# EAGLE board tkl3 (EAGLE 9.5.2)
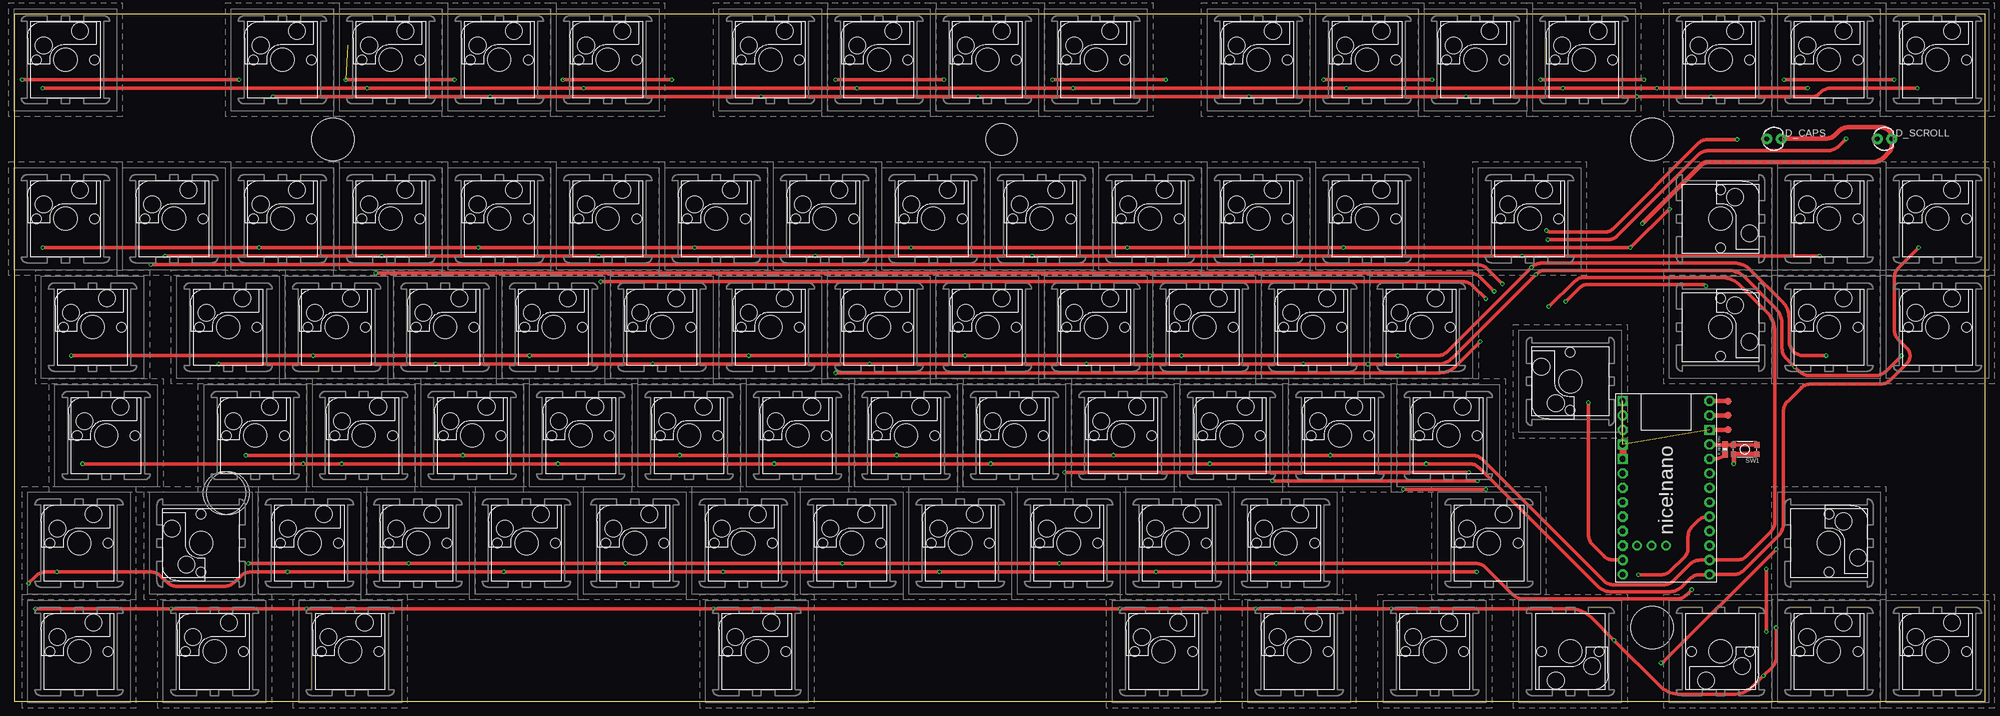
[diagram p2: board, top side]
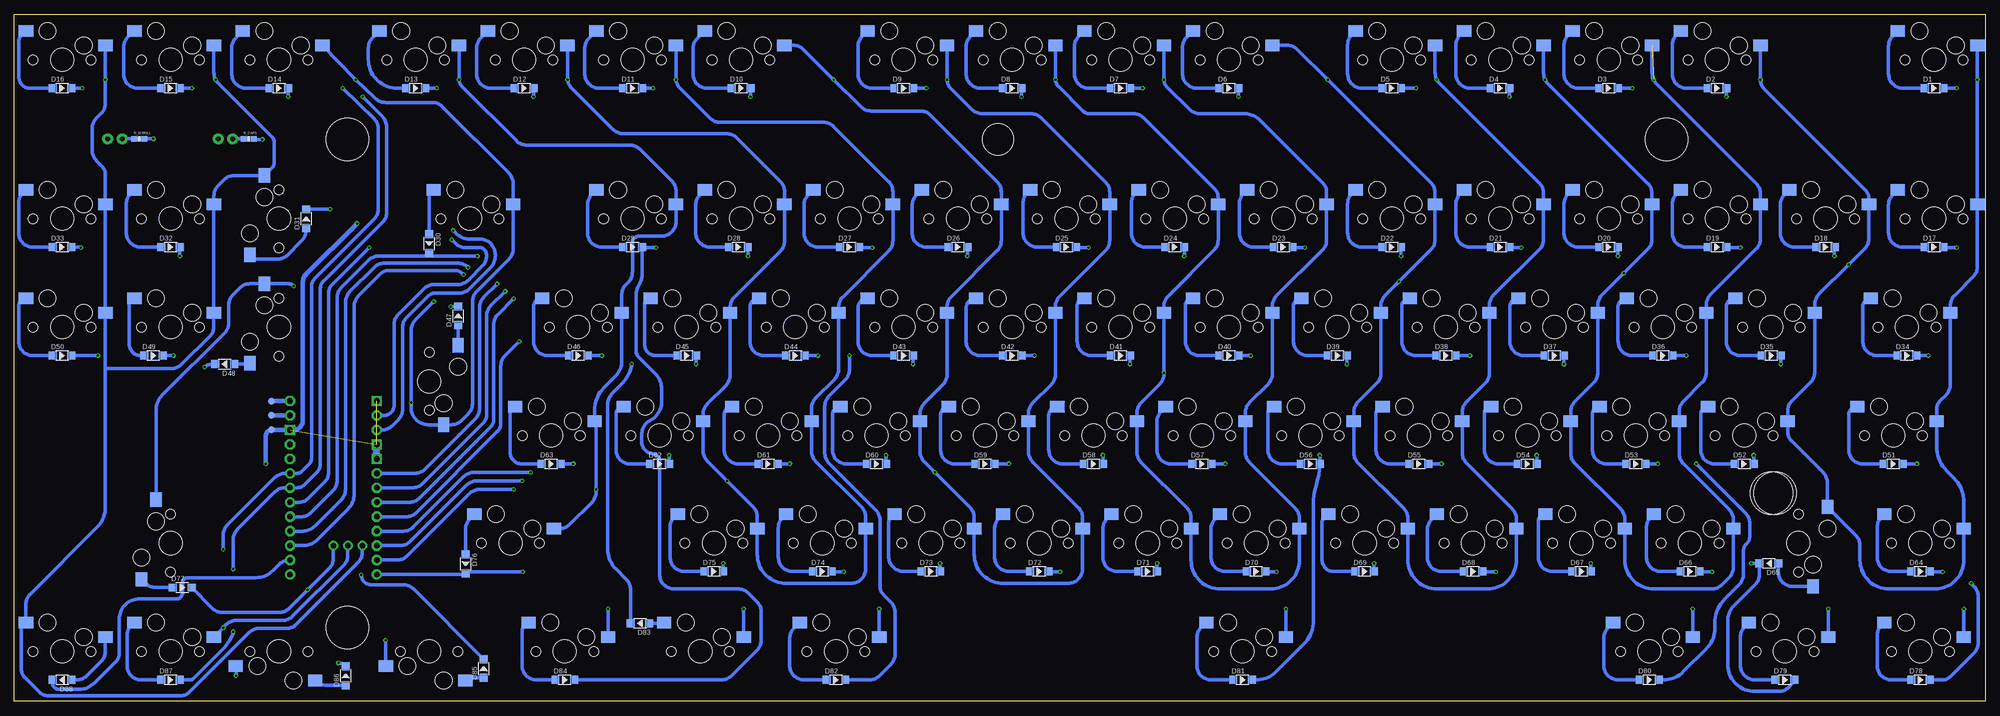
[diagram p3: board, bottom side, seen from below]

Size 346.2 x 120.73 mm. Coordinates in mm from the lower left corner, seen from the top.
Outline: 0,120.73 0,0 346.2,0 346.2,120.73 0,120.73
Copper layers (1*16): Top 0.035mm / dielectric 1.5mm / Bottom 0.035mm
Design rules "default *": minimum track width 6mil, minimum drill 0.35mm, track to track 16mil, track to pad 16mil, pad to pad 16mil, via to via 16mil, smd to smd 6mil, copper to edge 10mil, drill to drill 6mil, minimum pad ring 10mil, minimum via ring 8mil, stop-mask expansion 4mil, vias tented up to drill 0mil, thermal gap 10mil
Net classes: 0 default: width 0.152 mm, drill 0.305 mm, clearance 0.152 mm; 2 gnd: width 0.254 mm, drill 0.584 mm, clearance 0.203 mm
Holes 7.5 mm at 55.95,98.73 287.7,98.73 287.7,12.95 36.95,36.6 37.58,36.6
Holes 5.5 mm at 173.4,98.73
tKeepout: 13 lines

## Footprints (pad centres in the part's own frame; a part is rotated, then mirrored left to right if it is on the bottom)
SOD-123 = smd 1.397 x 1.397: + -1.651,0; - 1.651,0
LED3MM = drill 0.813 pad 1.88: A -1.27,0; K 1.27,0
CHERRY_MX_NO_LED_SOCKET_1U = smd 2.5 x 2 bottom: PIN1 6.35,5.08; PIN2 -7.62,2.54 | hole 4.089: 0,0 | hole 1.707: -5.08,0; 5.08,0 | hole 2.95: 2.54,5.08; -3.81,2.54
0603-RES = smd 1.1 x 1: 1 -0.85,0; 2 0.85,0
TACTILE_SWITCH_SMD_4.6X2.8MM = smd 0.9 x 1: 1 -2.05,-0.8; 2 2.05,-0.8; 3 2.05,0.8; 4 -2.05,0.8
PAD.03X.05 = smd 1.27 x 1.27: P$1 0,0
NICE_NANO = drill 1 pad 1.778 square: P1 0,0; P4 -7.62,0; P5 -10.16,0; P24 -5.08,-15.24 | drill 1 pad 1.778 octagon: P2 -2.54,0; P3 -5.08,0; P6 -12.7,0; P7 -15.24,0; P8 -17.78,0; P9 -20.32,0; P10 -22.86,0; P11 -25.4,0; P22 -10.16,-15.24; P23 -7.62,-15.24; P25 -2.54,-15.24; P26 0,-15.24 | drill 1 pad 1.778: P12 -27.94,0; P13 -30.48,0; P14 -30.48,-15.24; P15 -27.94,-15.24; P16 -25.4,-15.24; P17 -22.86,-15.24; P18 -20.32,-15.24; P19 -17.78,-15.24; P20 -15.24,-15.24; P21 -12.7,-15.24 | drill 1 pad 1.676: P27 -25.4,-2.54; P28 -25.4,-5.08; P29 -25.4,-7.62

## Placement (x,y rotation side)
D1  MMSD4148-sod123  [SOD-123]  9,107.73 0 bottom
D2  MMSD4148-sod123  [SOD-123]  47.1,107.73 0 bottom
D3  MMSD4148-sod123  [SOD-123]  66.15,107.73 0 bottom
D4  MMSD4148-sod123  [SOD-123]  85.2,107.73 0 bottom
D5  MMSD4148-sod123  [SOD-123]  104.25,107.73 0 bottom
D6  MMSD4148-sod123  [SOD-123]  132.82,107.73 0 bottom
D7  MMSD4148-sod123  [SOD-123]  151.88,107.73 0 bottom
D8  MMSD4148-sod123  [SOD-123]  170.93,107.73 0 bottom
D9  MMSD4148-sod123  [SOD-123]  189.97,107.73 0 bottom
D10  MMSD4148-sod123  [SOD-123]  218.55,107.73 0 bottom
D11  MMSD4148-sod123  [SOD-123]  237.6,107.73 0 bottom
D12  MMSD4148-sod123  [SOD-123]  256.65,107.73 0 bottom
D13  MMSD4148-sod123  [SOD-123]  275.7,107.73 0 bottom
D14  MMSD4148-sod123  [SOD-123]  299.7,107.73 0 bottom
D15  MMSD4148-sod123  [SOD-123]  318.75,107.73 0 bottom
D16  MMSD4148-sod123  [SOD-123]  337.8,107.73 0 bottom
D17  MMSD4148-sod123  [SOD-123]  9,79.79 0 bottom
D18  MMSD4148-sod123  [SOD-123]  28.05,79.79 0 bottom
D19  MMSD4148-sod123  [SOD-123]  47.1,79.79 0 bottom
D20  MMSD4148-sod123  [SOD-123]  66.15,79.79 0 bottom
D21  MMSD4148-sod123  [SOD-123]  85.2,79.79 0 bottom
D22  MMSD4148-sod123  [SOD-123]  104.25,79.79 0 bottom
D23  MMSD4148-sod123  [SOD-123]  123.3,79.79 0 bottom
D24  MMSD4148-sod123  [SOD-123]  142.35,79.79 0 bottom
D25  MMSD4148-sod123  [SOD-123]  161.4,79.79 0 bottom
D26  MMSD4148-sod123  [SOD-123]  180.45,79.79 0 bottom
D27  MMSD4148-sod123  [SOD-123]  199.5,79.79 0 bottom
D28  MMSD4148-sod123  [SOD-123]  219,79.79 0 bottom
D29  MMSD4148-sod123  [SOD-123]  237.6,79.79 0 bottom
D30  MMSD4148-sod123  [SOD-123]  273.32,80.42 270 bottom
D31  MMSD4148-sod123  [SOD-123]  294.94,84.79 90 bottom
D32  MMSD4148-sod123  [SOD-123]  318.75,79.79 0 bottom
D33  MMSD4148-sod123  [SOD-123]  337.8,79.79 0 bottom
D34  MMSD4148-sod123  [SOD-123]  13.76,60.73 0 bottom
D35  MMSD4148-sod123  [SOD-123]  37.58,60.73 0 bottom
D36  MMSD4148-sod123  [SOD-123]  56.62,60.73 0 bottom
D37  MMSD4148-sod123  [SOD-123]  75.67,60.73 0 bottom
D38  MMSD4148-sod123  [SOD-123]  94.72,60.73 0 bottom
D39  MMSD4148-sod123  [SOD-123]  113.78,60.73 0 bottom
D40  MMSD4148-sod123  [SOD-123]  132.82,60.73 0 bottom
D41  MMSD4148-sod123  [SOD-123]  151.88,60.73 0 bottom
D42  MMSD4148-sod123  [SOD-123]  170.93,60.73 0 bottom
D43  MMSD4148-sod123  [SOD-123]  189.97,60.73 0 bottom
D44  MMSD4148-sod123  [SOD-123]  209,60.73 0 bottom
D45  MMSD4148-sod123  [SOD-123]  228.07,60.73 0 bottom
D46  MMSD4148-sod123  [SOD-123]  247.12,60.73 0 bottom
D47  MMSD4148-sod123  [SOD-123]  268.25,67.73 90 bottom
D48  MMSD4148-sod123  [SOD-123]  309.25,59.23 180 bottom
D49  MMSD4148-sod123  [SOD-123]  321.75,60.73 0 bottom
D50  MMSD4148-sod123  [SOD-123]  337.8,60.73 0 bottom
D51  MMSD4148-sod123  [SOD-123]  16.14,41.69 0 bottom
D52  MMSD4148-sod123  [SOD-123]  42.34,41.69 0 bottom
D53  MMSD4148-sod123  [SOD-123]  61.39,41.69 0 bottom
D54  MMSD4148-sod123  [SOD-123]  80.44,41.69 0 bottom
D55  MMSD4148-sod123  [SOD-123]  99.49,41.69 0 bottom
D56  MMSD4148-sod123  [SOD-123]  118.54,41.69 0 bottom
D57  MMSD4148-sod123  [SOD-123]  137.59,41.69 0 bottom
D58  MMSD4148-sod123  [SOD-123]  156.64,41.69 0 bottom
D59  MMSD4148-sod123  [SOD-123]  175.69,41.69 0 bottom
D60  MMSD4148-sod123  [SOD-123]  194.74,41.69 0 bottom
D61  MMSD4148-sod123  [SOD-123]  213.79,41.69 0 bottom
D62  MMSD4148-sod123  [SOD-123]  232.84,41.69 0 bottom
D63  MMSD4148-sod123  [SOD-123]  251.89,41.69 0 bottom
D64  MMSD4148-sod123  [SOD-123]  11.38,22.8 0 bottom
D65  MMSD4148-sod123  [SOD-123]  38,24.23 180 bottom
D66  MMSD4148-sod123  [SOD-123]  51.86,22.8 0 bottom
D67  MMSD4148-sod123  [SOD-123]  70.91,22.8 0 bottom
D68  MMSD4148-sod123  [SOD-123]  89.96,22.8 0 bottom
D69  MMSD4148-sod123  [SOD-123]  109.01,22.8 0 bottom
D70  MMSD4148-sod123  [SOD-123]  128.06,22.8 0 bottom
D71  MMSD4148-sod123  [SOD-123]  147.11,22.8 0 bottom
D72  MMSD4148-sod123  [SOD-123]  166.16,22.8 0 bottom
D73  MMSD4148-sod123  [SOD-123]  185.21,22.8 0 bottom
D74  MMSD4148-sod123  [SOD-123]  204.26,22.8 0 bottom
D75  MMSD4148-sod123  [SOD-123]  223.31,22.8 0 bottom
D76  MMSD4148-sod123  [SOD-123]  266.93,24.14 270 bottom
D77  MMSD4148-sod123  [SOD-123]  316.68,19.98 0 bottom
D78  MMSD4148-sod123  [SOD-123]  11.38,3.75 0 bottom
D79  MMSD4148-sod123  [SOD-123]  35.19,3.75 0 bottom
D80  MMSD4148-sod123  [SOD-123]  59.01,3.75 0 bottom
D81  MMSD4148-sod123  [SOD-123]  130.44,3.75 0 bottom
D82  MMSD4148-sod123  [SOD-123]  201.88,3.75 0 bottom
D83  MMSD4148-sod123  [SOD-123]  236.31,13.71 180 bottom
D84  MMSD4148-sod123  [SOD-123]  249.51,3.75 0 bottom
D85  MMSD4148-sod123  [SOD-123]  263.75,5.75 90 bottom
D86  MMSD4148-sod123  [SOD-123]  288,4.48 90 bottom
D87  MMSD4148-sod123  [SOD-123]  318.75,3.75 0 bottom
D88  MMSD4148-sod123  [SOD-123]  337.8,3.75 180 bottom
D_CAPS  [LED3MM]  309.1,98.83 0 top
D_SCROLL  [LED3MM]  328.5,98.83 0 top
F_F2  CHERRY_MX1U  [CHERRY_MX_NO_LED_SOCKET_1U]  66.15,112.73 0 top
K_0  CHERRY_MX1U  [CHERRY_MX_NO_LED_SOCKET_1U]  199.5,84.79 0 top
K_1  CHERRY_MX1U  [CHERRY_MX_NO_LED_SOCKET_1U]  28.05,84.79 0 top
K_2  CHERRY_MX1U  [CHERRY_MX_NO_LED_SOCKET_1U]  47.1,84.79 0 top
K_3  CHERRY_MX1U  [CHERRY_MX_NO_LED_SOCKET_1U]  66.15,84.79 0 top
K_4  CHERRY_MX1U  [CHERRY_MX_NO_LED_SOCKET_1U]  85.2,84.79 0 top
K_5  CHERRY_MX1U  [CHERRY_MX_NO_LED_SOCKET_1U]  104.25,84.79 0 top
K_6  CHERRY_MX1U  [CHERRY_MX_NO_LED_SOCKET_1U]  123.3,84.79 0 top
K_7  CHERRY_MX1U  [CHERRY_MX_NO_LED_SOCKET_1U]  142.35,84.79 0 top
K_8  CHERRY_MX1U  [CHERRY_MX_NO_LED_SOCKET_1U]  161.4,84.79 0 top
K_9  CHERRY_MX1U  [CHERRY_MX_NO_LED_SOCKET_1U]  180.45,84.79 0 top
K_A  CHERRY_MX1U  [CHERRY_MX_NO_LED_SOCKET_1U]  42.34,46.69 0 top
K_B  CHERRY_MX1U  [CHERRY_MX_NO_LED_SOCKET_1U]  128.06,27.8 0 top
K_BACK  CHERRY_MX1U  [CHERRY_MX_NO_LED_SOCKET_1U]  266.18,84.79 0 top
K_C  CHERRY_MX1U  [CHERRY_MX_NO_LED_SOCKET_1U]  89.96,27.8 0 top
K_CAPSLOCK  CHERRY_MX1U  [CHERRY_MX_NO_LED_SOCKET_1U]  16.14,46.69 0 top
K_COMA  CHERRY_MX1U  [CHERRY_MX_NO_LED_SOCKET_1U]  185.21,27.8 0 top
K_D  CHERRY_MX1U  [CHERRY_MX_NO_LED_SOCKET_1U]  80.44,46.69 0 top
K_DELETE  CHERRY_MX1U  [CHERRY_MX_NO_LED_SOCKET_1U]  299.7,65.74 270 top
K_DOT  CHERRY_MX1U  [CHERRY_MX_NO_LED_SOCKET_1U]  204.26,27.8 0 top
K_DOWN  CHERRY_MX1U  [CHERRY_MX_NO_LED_SOCKET_1U]  318.75,8.75 0 top
K_E  CHERRY_MX1U  [CHERRY_MX_NO_LED_SOCKET_1U]  75.67,65.74 0 top
K_ECH  CHERRY_MX1U  [CHERRY_MX_NO_LED_SOCKET_1U]  9,112.73 0 top
K_END  CHERRY_MX1U  [CHERRY_MX_NO_LED_SOCKET_1U]  318.75,65.74 0 top
K_ENTER  CHERRY_MX1U  [CHERRY_MX_NO_LED_SOCKET_1U]  273.32,56.22 90 top
K_F  CHERRY_MX1U  [CHERRY_MX_NO_LED_SOCKET_1U]  99.49,46.69 0 top
K_F1  CHERRY_MX1U  [CHERRY_MX_NO_LED_SOCKET_1U]  47.1,112.73 0 top
K_F3  CHERRY_MX1U  [CHERRY_MX_NO_LED_SOCKET_1U]  85.2,112.73 0 top
K_F4  CHERRY_MX1U  [CHERRY_MX_NO_LED_SOCKET_1U]  104.25,112.73 0 top
K_F5  CHERRY_MX1U  [CHERRY_MX_NO_LED_SOCKET_1U]  132.82,112.73 0 top
K_F6  CHERRY_MX1U  [CHERRY_MX_NO_LED_SOCKET_1U]  151.88,112.73 0 top
K_F7  CHERRY_MX1U  [CHERRY_MX_NO_LED_SOCKET_1U]  170.93,112.73 0 top
K_F8  CHERRY_MX1U  [CHERRY_MX_NO_LED_SOCKET_1U]  189.97,112.73 0 top
K_F9  CHERRY_MX1U  [CHERRY_MX_NO_LED_SOCKET_1U]  218.55,112.73 0 top
K_F10  CHERRY_MX1U  [CHERRY_MX_NO_LED_SOCKET_1U]  237.6,112.73 0 top
K_F11  CHERRY_MX1U  [CHERRY_MX_NO_LED_SOCKET_1U]  256.65,112.73 0 top
K_F12  CHERRY_MX1U  [CHERRY_MX_NO_LED_SOCKET_1U]  275.7,112.73 0 top
K_FN  CHERRY_MX1U  [CHERRY_MX_NO_LED_SOCKET_1U]  273.32,8.75 180 top
K_G  CHERRY_MX1U  [CHERRY_MX_NO_LED_SOCKET_1U]  118.54,46.69 0 top
K_H  CHERRY_MX1U  [CHERRY_MX_NO_LED_SOCKET_1U]  137.59,46.69 0 top
K_HOME  CHERRY_MX1U  [CHERRY_MX_NO_LED_SOCKET_1U]  318.75,84.79 0 top
K_I  CHERRY_MX1U  [CHERRY_MX_NO_LED_SOCKET_1U]  170.93,65.74 0 top
K_INSERT  CHERRY_MX1U  [CHERRY_MX_NO_LED_SOCKET_1U]  299.7,84.79 270 top
K_J  CHERRY_MX1U  [CHERRY_MX_NO_LED_SOCKET_1U]  156.64,46.69 0 top
K_K  CHERRY_MX1U  [CHERRY_MX_NO_LED_SOCKET_1U]  175.69,46.69 0 top
K_L  CHERRY_MX1U  [CHERRY_MX_NO_LED_SOCKET_1U]  194.74,46.69 0 top
K_LALT  CHERRY_MX1U  [CHERRY_MX_NO_LED_SOCKET_1U]  59.01,8.75 0 top
K_LBRA  CHERRY_MX1U  [CHERRY_MX_NO_LED_SOCKET_1U]  228.07,65.74 0 top
K_LCTRL  CHERRY_MX1U  [CHERRY_MX_NO_LED_SOCKET_1U]  11.38,8.75 0 top
K_LEFT  CHERRY_MX1U  [CHERRY_MX_NO_LED_SOCKET_1U]  299.7,8.75 180 top
K_LSHFT  CHERRY_MX1U  [CHERRY_MX_NO_LED_SOCKET_1U]  11.38,27.8 0 top
K_LWIN  CHERRY_MX1U  [CHERRY_MX_NO_LED_SOCKET_1U]  35.19,8.75 0 top
K_M  CHERRY_MX1U  [CHERRY_MX_NO_LED_SOCKET_1U]  166.16,27.8 0 top
K_MINUS  CHERRY_MX1U  [CHERRY_MX_NO_LED_SOCKET_1U]  218.55,84.79 0 top
K_N  CHERRY_MX1U  [CHERRY_MX_NO_LED_SOCKET_1U]  147.11,27.8 0 top
K_O  CHERRY_MX1U  [CHERRY_MX_NO_LED_SOCKET_1U]  189.97,65.74 0 top
K_P  CHERRY_MX1U  [CHERRY_MX_NO_LED_SOCKET_1U]  209.03,65.74 0 top
K_PAUSE  CHERRY_MX1U  [CHERRY_MX_NO_LED_SOCKET_1U]  337.8,112.73 0 top
K_PDW  CHERRY_MX1U  [CHERRY_MX_NO_LED_SOCKET_1U]  337.8,65.74 0 top
K_PIPE  CHERRY_MX1U  [CHERRY_MX_NO_LED_SOCKET_1U]  32.81,27.8 90 top
K_PLUS  CHERRY_MX1U  [CHERRY_MX_NO_LED_SOCKET_1U]  237.6,84.79 0 top
K_PRNT  CHERRY_MX1U  [CHERRY_MX_NO_LED_SOCKET_1U]  299.7,112.73 0 top
K_PUP  CHERRY_MX1U  [CHERRY_MX_NO_LED_SOCKET_1U]  337.8,84.79 0 top
K_Q  CHERRY_MX1U  [CHERRY_MX_NO_LED_SOCKET_1U]  37.58,65.74 0 top
K_QUOTE  CHERRY_MX1U  [CHERRY_MX_NO_LED_SOCKET_1U]  232.84,46.69 0 top
K_R  CHERRY_MX1U  [CHERRY_MX_NO_LED_SOCKET_1U]  94.72,65.74 0 top
K_RALT  CHERRY_MX1U  [CHERRY_MX_NO_LED_SOCKET_1U]  201.88,8.75 0 top
K_RBRA  CHERRY_MX1U  [CHERRY_MX_NO_LED_SOCKET_1U]  247.12,65.74 0 top
K_RCTRL  CHERRY_MX1U  [CHERRY_MX_NO_LED_SOCKET_1U]  249.51,8.75 0 top
K_RIGHT  CHERRY_MX1U  [CHERRY_MX_NO_LED_SOCKET_1U]  337.8,8.75 0 top
K_RSHFT  CHERRY_MX1U  [CHERRY_MX_NO_LED_SOCKET_1U]  259.03,27.8 0 top
K_RWIN  CHERRY_MX1U  [CHERRY_MX_NO_LED_SOCKET_1U]  225.69,8.75 0 top
K_S  CHERRY_MX1U  [CHERRY_MX_NO_LED_SOCKET_1U]  61.39,46.69 0 top
K_SCROL  CHERRY_MX1U  [CHERRY_MX_NO_LED_SOCKET_1U]  318.75,112.73 0 top
K_SEMIC  CHERRY_MX1U  [CHERRY_MX_NO_LED_SOCKET_1U]  213.79,46.69 0 top
K_SLASH  CHERRY_MX1U  [CHERRY_MX_NO_LED_SOCKET_1U]  223.31,27.8 0 top
K_SPACE  CHERRY_MX1U  [CHERRY_MX_NO_LED_SOCKET_1U]  130.44,8.75 0 top
K_T  CHERRY_MX1U  [CHERRY_MX_NO_LED_SOCKET_1U]  113.78,65.74 0 top
K_TAB  CHERRY_MX1U  [CHERRY_MX_NO_LED_SOCKET_1U]  13.76,65.74 0 top
K_U  CHERRY_MX1U  [CHERRY_MX_NO_LED_SOCKET_1U]  151.88,65.74 0 top
K_UP  CHERRY_MX1U  [CHERRY_MX_NO_LED_SOCKET_1U]  318.75,27.8 270 top
K_V  CHERRY_MX1U  [CHERRY_MX_NO_LED_SOCKET_1U]  109.01,27.8 0 top
K_W  CHERRY_MX1U  [CHERRY_MX_NO_LED_SOCKET_1U]  56.62,65.74 0 top
K_WAVE  CHERRY_MX1U  [CHERRY_MX_NO_LED_SOCKET_1U]  251.89,46.69 0 top
K_X  CHERRY_MX1U  [CHERRY_MX_NO_LED_SOCKET_1U]  70.91,27.8 0 top
K_Y  CHERRY_MX1U  [CHERRY_MX_NO_LED_SOCKET_1U]  132.82,65.74 0 top
K_Z  CHERRY_MX1U  [CHERRY_MX_NO_LED_SOCKET_1U]  51.86,27.8 0 top
R_CAPS  4.7K  [0603-RES]  305,98.83 0 bottom
R_RESETPU  4.7K  [0603-RES]  300.5,44.23 90 top
R_SCROLL  4.7K  [0603-RES]  324.25,98.83 0 bottom
SW1  [TACTILE_SWITCH_SMD_4.6X2.8MM]  304,44.23 180 top
TP1  TEST-POINT3X5  [PAD.03X.05]  301,52.73 0 bottom
TP3  TEST-POINT3X5  [PAD.03X.05]  301,50.23 0 bottom
TP4  TEST-POINT3X5  [PAD.03X.05]  301,47.68 0 bottom
TP6  TEST-POINT3X5  [PAD.03X.05]  301,52.73 0 top
TP7  TEST-POINT3X5  [PAD.03X.05]  301,50.23 0 top
TP8  TEST-POINT3X5  [PAD.03X.05]  301,47.68 0 top
U$1  NICE_NANO  [NICE_NANO]  282.52,52.76 90 top
Κ_GRV  CHERRY_MX1U  [CHERRY_MX_NO_LED_SOCKET_1U]  9,84.79 0 top

## Tracks (layer width: path | path; a pad name or v marks a point on that pad's centre or on a via)
C0  (via drill 0.35)
  Top 0.61: v261.38,73.36 258.74,75.99 arc45 256.95,76.73 v24,76.73 | v1.38,109.23 v39.48,109.23
  Bottom 0.61: U$1.P6 275.85,40.06 arc-45 274.06,40.8 265.12,49.74 arc-45 264.48,51.29 264.48,69.2 arc45 263.73,71 v261.38,73.36 | K_1.PIN2 20.43,88.36 arc-45 21,89.73 38.74,107.47 arc45 39.48,109.26 v39.48,109.23
  Bottom 0.635: K_ECH.PIN2 v1.38,109.23 Κ_GRV.PIN2 1.38,76.4 arc45 2.12,74.61 5.4,71.33 arc-45 6.14,69.54 K_TAB.PIN2 6.14,55.64 arc45 6.89,53.85 8,52.73 arc-45 8.52,51.47 K_CAPSLOCK.PIN2 8.52,44.72 arc-45 6.78,40.51 5.5,39.24 arc45 3.76,35.03 K_LSHFT.PIN2 3.76,24.81 arc90 8.84,19.73 16.92,19.73 arc90 22,24.81 22,27.37 arc-45 22.74,29.16 K_PIPE.PIN1 27.73,38.41 arc-45 28.48,40.21 33.97,45.71 arc45 34.72,47.5 K_A.PIN2 34.72,51 arc45 34,52.73 30.7,56.03 arc-45 29.95,57.83 K_Q.PIN2 29.95,69.72 arc45 29.21,71.52 v24,76.73 21.17,79.56 arc-45 20.43,81.35 K_1.PIN2 | v39.48,109.23 K_F1.PIN2
C1  (via drill 0.35)  (1 unrouted)
  Top 0.61: v63.5,75.23 255.7,75.23 arc-45 257.49,74.49 v259.94,72.04 | v58.25,109.23 v77.33,109.23
  Bottom 0.61: 44.24,24.81 44.24,23.54 arc45 44.99,21.75 46.26,20.48 arc45 48.05,19.73 58.21,19.73 | U$1.P7 276.27,37.52 arc-45 274.47,38.26 263.83,48.9 arc-45 263.23,50.37 263.23,67.7 arc45 262.48,69.5 v259.94,72.04 | 40.22,90.96 57.79,108.52 arc45 58.53,110.31 F_F2.PIN2
  Bottom 0.635: 44.24,24.81 K_Z.PIN2 44.24,31.92 arc-45 44.99,33.72 53.02,41.76 arc45 53.77,43.55 K_S.PIN2 53.77,50.91 arc45 53.02,52.71 49.75,55.98 arc-45 49.01,57.78 K_W.PIN2 49.01,69.67 arc45 48.26,71.47 40.22,79.51 arc-45 39.48,81.3 K_2.PIN2 39.48,89.16 arc-45 40.22,90.96 | 58.21,19.73 arc90 63.29,24.81 K_X.PIN2 63.29,31.97 arc-45 64.04,33.77 72.07,41.81 arc45 72.82,43.6 K_D.PIN2 72.82,50.86 arc45 72.07,52.66 68.8,55.93 arc-45 68.06,57.73 K_E.PIN2 68.06,69.62 arc45 67.31,71.42 v63.5,75.23 59.27,79.46 arc-45 58.53,81.25 K_3.PIN2 58.53,89.21 arc-45 59.27,91.01 76.84,108.57 arc45 77.58,110.36 K_F3.PIN2
C2  (via drill 0.35)  (1 unrouted)
  Top 0.61: v103,73.73 254.45,73.73 arc-45 256.24,72.99 v258.5,70.73 | v115.5,109.23 96.5,109.23
  Bottom 0.61: U$1.P8 276.81,34.98 arc-45 275.01,35.72 262.55,48.19 arc-45 261.98,49.56 261.98,64.61 261.98,65.15 261.98,66.2 arc45 261.23,68 v258.5,70.73 | K_F4.PIN2 96.63,110.41 arc-45 95.89,108.62 78.32,91.06
  Bottom 0.635: 78.32,91.06 arc45 77.58,89.26 K_4.PIN2 77.58,81.2 arc45 78.32,79.41 86.36,71.37 arc-45 87.11,69.57 K_R.PIN2 87.11,57.68 arc45 87.85,55.88 91.12,52.61 arc-45 91.87,50.81 K_F.PIN2 91.87,43.65 arc-45 91.12,41.86 83.09,33.82 arc45 82.34,32.02 K_C.PIN2 82.34,24.81 arc90 87.42,19.73 96.31,19.73 arc90 101.39,24.81 K_V.PIN2 101.39,32.07 arc-45 102.14,33.87 110.17,41.91 arc45 110.92,43.7 K_G.PIN2 110.92,50.76 arc45 110.17,52.56 106.9,55.83 arc-45 106.16,57.63 K_T.PIN2 106.16,69.52 arc45 105.41,71.32 v103,73.73 97.37,79.36 arc-45 96.63,81.15 K_5.PIN2 96.63,89.31 arc-45 97.37,91.11 v115.5,109.23 120.8,114.53 arc-45 122.59,115.27 K_F5.PIN2
  other vias: 96.39,109.23
C3  (via drill 0.35)
  Top 0.61: v144.25,57.73 250.45,57.73 arc45 253.1,58.83 v257.5,63.23 | v144.25,109.23 163,109.23 arc-45 163.26,109.34 v163.31,109.23
  Bottom 0.61: 149.55,103.23 157.24,103.23 arc45 158.54,103.77 162.74,107.97 arc45 v163.31,109.23 K_F7.PIN2 | 130.05,103.23 137.74,103.23 arc45 139.89,104.12 143.69,107.92 arc45 v144.25,109.23 K_F6.PIN2 | U$1.P9 277.35,32.44 arc-45 275.55,33.18 261.44,47.3 arc-45 260.73,49.01 260.73,58.95 arc45 259.98,60.75 v257.5,63.23
  Bottom 0.635: 130.05,103.23 arc45 127.4,102.13 116.42,91.16 arc45 115.68,89.36 K_6.PIN2 115.68,81.1 arc45 116.42,79.31 124.46,71.27 arc-45 125.2,69.47 K_Y.PIN2 125.2,57.58 arc45 125.95,55.78 129.22,52.51 arc-45 129.97,50.71 K_H.PIN2 129.97,43.75 arc-45 129.22,41.96 121.19,33.92 arc45 120.44,32.12 K_B.PIN2 120.44,24.81 arc90 125.52,19.73 134.41,19.73 arc90 139.49,24.81 K_N.PIN2 139.49,32.17 arc-45 140.24,33.97 148.27,42.01 arc45 149.02,43.8 K_J.PIN2 149.02,50.66 arc45 148.27,52.46 145,55.73 arc-45 144.25,57.53 v144.25,57.73 K_U.PIN2 144.25,69.42 arc45 143.51,71.22 135.47,79.26 arc-45 134.73,81.05 K_7.PIN2 134.73,88.41 arc-45 135.47,90.21 147.76,102.49 arc-45 149.55,103.23
C4  (via drill 0.35)
  Top 0.61: v255.5,40.23 v184.5,40.23 | v182.35,109.23 v202.25,109.23
  Bottom 0.61: 187.05,103.73 195.7,103.73 arc45 197.49,104.48 v202.25,109.23 207.55,114.53 arc-45 209.34,115.27 K_F9.PIN2 | 167.55,103.23 175.99,103.23 arc45 178.14,104.12 181.61,107.59 arc45 v182.35,109.23 K_F8.PIN2 | 177.59,32.27 K_COMA.PIN2 177.59,25.81 arc-90 172.51,20.73 161.08,20.73 arc-90 158.54,23.27 158.54,24.81 | v255.5,40.23 265.45,40.23 arc-45 267.24,39.49 276.09,30.64 arc45 277.89,29.9 U$1.P10
  Bottom 0.635: 167.55,103.23 arc45 165.76,102.49 154.52,91.26 arc45 153.78,89.46 K_8.PIN2 153.78,81 arc45 154.52,79.21 162.56,71.17 arc-45 163.31,69.37 K_I.PIN2 163.31,57.48 arc45 164.05,55.68 167.32,52.41 arc-45 168.07,50.61 K_K.PIN2 168.07,43.85 arc-45 167.32,42.06 159.29,34.02 arc45 158.54,32.22 K_M.PIN2 158.54,24.81 | 187.05,103.73 arc45 185.26,102.99 173.57,91.31 arc45 172.83,89.51 K_9.PIN2 172.83,80.95 arc45 173.57,79.16 181.61,71.12 arc-45 182.35,69.32 K_O.PIN2 182.35,57.43 arc45 183.1,55.63 186.37,52.36 arc-45 187.12,50.56 K_L.PIN2 187.12,43.9 arc-45 186.37,42.11 v184.5,40.23 178.34,34.07 arc45 177.59,32.27
C5  (via drill 0.35)
  Top 0.61: v257,38.73 v221,38.73 | v229.98,109.23 v249.03,109.23
  Bottom 0.61: 221.05,99.73 239.2,99.73 arc45 240.99,100.48 248.29,107.77 arc45 249.03,109.56 v249.03,109.23 K_F11.PIN2 | 204.05,101.73 222.2,101.73 arc45 223.99,102.48 229.24,107.72 arc45 v229.98,109.23 K_F10.PIN2 | 215.69,32.37 K_SLASH.PIN2 215.69,25.81 arc-90 210.61,20.73 199.18,20.73 arc-90 196.64,23.27 K_DOT.PIN2 196.64,32.32 | v257,38.73 264.95,38.73 arc-45 266.74,37.99 276.63,28.1 arc45 278.43,27.36 U$1.P11
  Bottom 0.635: 204.05,101.73 arc45 202.26,100.99 192.62,91.36 arc45 191.88,89.56 K_0.PIN2 191.88,80.9 arc45 192.62,79.11 200.66,71.07 arc-45 201.41,69.27 K_P.PIN2 201.41,58.38 arc45 202.15,56.58 205.42,53.31 arc-45 206.17,51.51 K_SEMIC.PIN2 206.17,43.95 arc-45 205.42,42.16 197.39,34.12 arc45 196.64,32.32 | 215.69,32.37 arc-45 216.44,34.17 v221,38.73 224.47,42.21 arc45 225.22,44 K_QUOTE.PIN2 225.22,50.46 arc45 224.47,52.26 221.2,55.53 arc-45 220.46,57.33 K_LBRA.PIN2 220.46,69.22 arc45 219.71,71.02 211.67,79.06 arc-45 210.93,80.85 K_MINUS.PIN2 210.93,89.61 arc-45 211.67,91.41 219.26,98.99 arc-45 221.05,99.73
C6  (via drill 0.35)
  Top 0.61: v258.5,37.23 v244,37.23 | v297.12,72.98 arc45 296.52,73.23 276.23,73.23 arc45 274.99,72.72 v272.5,70.23 | v276.5,52.48 276.5,29.28 arc45 277.24,27.49 279.17,25.56 arc45 280.97,24.82 U$1.P12 | v268.08,109.23 v286.27,109.23
  Bottom 0.61: 238.05,97.73 256.2,97.73 arc45 257.99,98.48 267.34,107.82 arc45 v268.08,109.23 K_F12.PIN2 | K_PRNT.PIN2 v286.27,109.23 282.78,105.98 arc-45 280.99,105.23 272.8,105.23 arc45 271.01,104.49 259.3,92.78 arc45 258.56,90.98 K_BACK.PIN2 258.56,79.48 arc45 259.3,77.68 264.98,72 arc-45 265.73,70.2 265.73,69.15 265.73,68.48 265.73,52.22 arc45 266.41,50.58 267.64,49.34 arc45 269.44,48.6 K_ENTER.PIN2 273.46,48.6 arc90 276.5,51.64 v276.5,52.48 276.5,65.18 arc45 275.76,66.98 v272.5,70.23 | 244.27,49.73 arc45 244,49.09 v244,37.23 244,36.78 arc45 244.74,34.99 248.65,31.08 arc45 250.44,30.34 K_RSHFT.PIN2 | K_UP.PIN2 321.29,51.14 arc45 320.19,53.79 309.24,64.74 arc-45 308.5,66.53 308.5,69.68 arc45 307.76,71.48 306.61,72.62 arc45 304.82,73.36 K_DELETE.PIN2 297.98,73.36 arc45 297.17,73.02 v297.12,72.98 | K_PLUS.PIN2 229.98,84.27 arc90 232.52,81.73 236.5,81.73 arc-90 237.62,80.61 237.62,75.44 arc45 238.39,73.59 238.76,73.22 arc-45 239.5,71.42 239.5,69.17 | v258.5,37.23 264.45,37.23 arc-45 266.24,36.49 277.17,25.56 arc45 278.97,24.82 U$1.P12
  Bottom 0.635: K_PLUS.PIN2 229.98,89.66 arc-45 230.72,91.46 236.26,96.99 arc-45 238.05,97.73 | 239.5,69.17 K_RBRA.PIN2 239.5,59.78 arc45 240.6,57.13 242.64,55.09 arc-45 244.27,51.16 244.27,49.73 K_WAVE.PIN2
C7  (via drill 0.35)
  Top 0.61: v310.85,109.23 v330.18,109.23
  Bottom 0.61: U$1.P27 285.06,26.22 arc45 285.81,24.42 296.8,13.43 arc45 298.25,12.83 303.15,12.83 arc-45 304.94,12.09 315.36,1.68 arc45 317.15,0.93 340.05,0.93 arc45 341.84,1.68 344.26,4.09 arc45 345,5.88 345,12.98 K_RIGHT.PIN1 344.15,17.03 arc45 343.41,18.83 331.67,30.56 arc-45 330.18,34.16 330.18,58.48 | K_SCROL.PIN2 311.13,110.41 arc-45 310.39,108.62 300.92,99.15 arc45 300.5,98.14 300.5,94.75 arc45 300.92,93.73 K_INSERT.PIN2 307.52,92.41 arc-45 309.31,91.67 310.39,90.6 arc-45 311.13,88.8 K_HOME.PIN2 K_END.PIN2 311.13,65.9 arc45 311.87,64.11 316.76,59.23 arc45 318.55,58.48 330.18,58.48 | 330.18,58.48 K_PDW.PIN2 K_PUP.PIN2 330.18,92.61 arc-45 330.75,93.98 331.76,94.99 arc45 332.5,96.78 332.5,100.68 arc45 331.76,102.48 330.92,103.31 arc-45 330.18,105.1 v330.18,109.23 K_PAUSE.PIN2
C8  (via drill 0.35)
  Top 0.61: v3.75,16.23 v27.57,16.23 v51.39,16.23 v122.82,16.23 v194.26,16.23 v218.07,16.23 v241.89,16.23 273.4,16.23 arc-45 276.99,14.74 v281,10.73 289.01,2.72 arc45 292.6,1.23 301.9,1.23 arc45 305.49,2.72 v307.25,4.48 308.76,5.99 arc45 309.5,7.78 309.5,12.98 v309.47,12.95
  Bottom 0.61: K_LWIN.PIN2 arc-45 27.5,11.47 arc45 K_LWIN.PIN2 | v307.25,4.48 K_LEFT.PIN2 | v3.75,16.23 arc-45 3.76,16.2 K_LCTRL.PIN2 | 194,11.92 arc45 K_RALT.PIN2 v194.26,16.23 | K_FN.PIN2 arc45 281,6.36 v281,10.73 | U$1.P28 287.61,25.68 arc45 288.35,23.88 297.26,14.98 arc45 299.05,14.23 307.14,14.23 arc-45 308.93,13.49 v309.47,12.95 K_DOWN.PIN2 | K_RCTRL.PIN2 v241.89,16.23 | K_RWIN.PIN2 v218.07,16.23 | K_SPACE.PIN2 v122.82,16.23 | K_LALT.PIN2 v51.39,16.23 | K_LWIN.PIN2 v27.57,16.23
GND  (via drill 0.35)  (2 unrouted)
  Top 0.61: 306.1,43.48 arc90 SW1.4
  Top 0.813: 329.77,99.25 D_SCROLL.K | v286,83.98 296.18,94.16 arc-45 297.55,94.73 326.45,94.73 arc45 328.24,95.48 329.32,96.55 arc45 329.77,97.63 D_SCROLL.K | TP4.P$1 U$1.P24 | v302,41.73 302,43.38 arc90 SW1.3 SW1.4 306.05,43.33 | D_SCROLL.K 329.77,99.08 arc90 327.99,100.86 322.18,100.86 arc45 320.38,100.11 319.84,99.58 arc-45 318.05,98.83 D_CAPS.K
  Top 1.27: U$1.P4 U$1.P5
  Bottom 0.61: 295.5,49.44 arc45 296,48.23 arc45 297.34,47.68 U$1.P24
  Bottom 0.813: v286,83.98 294.93,75.05 arc-45 295.5,73.68 295.5,49.44 arc104 U$1.P24 TP4.P$1 TP4.P$1 arc-90 302,46.68 v302,41.73
  Bottom 1.27: U$1.P5 U$1.P4
L0  (via drill 0.35)
  Top 0.61: v5,107.73 v62,107.73 v100,107.73 v148,107.73 v186,107.73 v234,107.73 v272,107.73 v288.5,107.73 v315,107.73 | v289.25,6.73 arc45 289.68,6.91 v309.5,26.73
  Bottom 0.61: D1.- v5,107.73 | D13.- v272,107.73 | D11.- v234,107.73 | D9.- v186,107.73 | D7.- v148,107.73 | D5.- v100,107.73 | D3.- v62,107.73 | v315,107.73 D15.- | v288.5,107.73 282.91,102.27 arc45 282.25,100.68 282.25,86.53 arc45 282.99,84.74 293.26,74.48 arc-45 294,72.68 294,42.53 arc45 294.3,41.81 295.75,40.35 arc45 296.47,40.06 U$1.P21 298.62,40.06 arc-45 300.42,39.31 308.76,30.98 arc-45 309.5,29.18 v309.5,26.73 | D86.- 288.14,6.27 arc-45 v289.25,6.73
L1  (via drill 0.35)
  Top 0.61: v45.45,106.23 v83.55,106.23 v131.17,106.23 v169.27,106.23 v216.9,106.23 v255,106.23 v285,106.23 v298.05,106.23 315.79,106.23 arc45 317,106.73 317.26,106.99 arc-45 319.05,107.73 v334.25,107.73 | v307.75,12.23 v307.75,23.23
  Bottom 0.61: D12.- arc45 D12.- v255,106.23 | D16.- 336,107.58 arc45 335.64,107.73 v334.25,107.73 | D87.- 315.28,3.75 arc-45 314.77,3.96 309.75,8.98 arc-24 307.75,12.03 v307.75,12.23 | v285,106.23 281.67,102.9 arc45 280.75,100.68 280.75,86.03 arc45 281.49,84.24 291.76,73.98 arc-45 292.5,72.18 292.5,41.44 arc45 292.95,40.37 295.29,38.02 arc45 296.51,37.52 U$1.P20 298.66,37.52 arc-45 300.46,36.77 307.01,30.23 arc-45 307.75,28.43 v307.75,23.23 | 45.5,107.61 arc45 D2.- 45.45,106.35 arc45 v45.45,106.23 | D4.- 83.55,106.35 arc-45 v83.55,106.23 | D6.- v131.17,106.23 | D8.- v169.27,106.23 | D10.- v216.9,106.23 | D14.- v298.05,106.23
L2  (via drill 0.35)
  Top 0.61: v5,79.73 v43,79.73 v81.5,79.73 v119.5,79.73 v157.5,79.73 v195.5,79.73 v233.5,79.73 v283.88,79.73 v290.75,86.48
  Bottom 0.61: D17.- 7.35,79.73 v5,79.73 | D19.- 45.45,79.73 v43,79.73 | D21.- 83.55,79.73 v81.5,79.73 | D23.- 121.65,79.73 v119.5,79.73 | D25.- 159.75,79.73 v157.5,79.73 | D27.- 197.85,79.73 v195.5,79.73 | v233.5,79.73 235.95,79.73 D29.- 235.95,74.81 arc33 236.38,73.36 arc-30 237,71.4 237,61.68 arc-45 236.51,60.49 233.6,57.58 arc45 232.5,54.93 232.5,52.73 arc49 233.71,49.9 arc14 234.52,49.32 arc-55 236,47.11 arc-12 236,45.48 arc-78 234,43.48 arc84 232.84,42.19 232.84,22.27 arc-90 230.3,19.73 219.05,19.73 arc45 217.26,18.99 215.74,17.48 arc45 215,15.68 215,10.78 arc45 215.74,8.99 220.24,4.49 arc45 222.03,3.75 D84.- | U$1.P19 296.13,34.98 arc-45 294.69,35.57 291.6,38.67 arc-45 291,40.11 291,71.68 arc45 290.34,73.26 v283.88,79.73 | v290.75,86.48 294.85,86.48 arc-45 D31.-
L3  (via drill 0.35)
  Top 0.61: v26.5,78.23 v64.5,78.23 v102.6,78.23 v140.7,78.23 v178.8,78.23 v217.35,78.23 v264.88,78.23 v317.1,78.23 | v285.25,22.23 289.2,22.23 arc45 290.99,22.98 293.26,25.24 arc45 294,27.03 294,28.93 arc-45 294.74,30.73 295.71,31.69 arc-45 297.51,32.44 U$1.P18
  Bottom 0.61: D18.- arc45 26.5,79.55 v26.5,78.23 | 264.9,78.26 v264.88,78.23 273.5,78.23 | D20.- D20.- arc45 D20.- v64.5,78.23 | D22.- v102.6,78.23 | D24.- v140.7,78.23 | D26.- v178.8,78.23 | 316.95,79.73 arc45 D32.- | 273.5,78.23 282.2,78.23 arc-45 283.99,77.49 288.76,72.73 arc-45 289.5,70.93 289.5,38.77 arc45 290.24,36.97 294.04,33.18 arc45 295.83,32.44 U$1.P18 | D85.- 276.09,19.74 arc-45 277.88,20.48 283.5,20.48 arc90 v285.25,22.23 | D30.- 273.5,78.77 273.5,78.23 | 317,79.55 arc-45 D32.- | D28.- v217.35,78.23 | D32.- v317.1,78.23
L4  (via drill 0.35)
  Top 0.61: v10,60.73 v52.5,60.73 v90.5,60.73 v129,60.73 v167,60.73 v199.5,60.73 v205,60.73 v243,60.73 249.95,60.73 arc45 251.74,61.48 v266.51,76.24 arc-45 268.3,76.98 302.15,76.98 arc-45 304.88,75.85 310.62,70.12 arc-45 311.75,67.38 311.75,63.27 arc90 314.29,60.73 v318.25,60.73
  Bottom 0.61: D34.- v10,60.73 | D36.- v52.5,60.73 | D38.- v90.5,60.73 | D40.- v129,60.73 | D42.- v167,60.73 | D44.- v205,60.73 | D46.- v243,60.73 | v318.25,60.73 D49.- | v199.5,60.73 199.5,58.28 arc45 200.24,56.49 203.01,53.73 arc-45 203.88,51.63 203.88,43.84 arc-45 203.01,41.74 194.99,33.73 arc45 194.12,31.63 194.12,20.23 arc-45 193.51,18.74 192.24,17.48 arc45 191.5,15.68 191.5,8.23 arc45 192.21,6.52 194.24,4.49 arc45 196.03,3.75 D82.- | U$1.P17 295.54,29.9 arc-45 293.38,30.79 288.89,35.28 arc-45 288,37.43 288,70.18 arc45 287.26,71.98 282.99,76.24 arc45 281.2,76.98 268.3,76.98 arc45 v266.51,76.24
L5  (via drill 0.35)
  Top 0.61: v35.92,59.23 v74,59.23 v112.12,59.23 v150.22,59.23 v188.32,59.23 v226.42,59.23 v237.75,59.23 249.95,59.23 arc45 252.6,60.33 v267.26,74.99 arc-45 269.05,75.73 300.9,75.73 arc-45 304.06,74.42 309.19,69.29 arc-45 310.5,66.13 310.5,62.03 arc45 311.24,60.24 v312.75,58.73 313.51,57.98 arc45 315.3,57.23 326.95,57.23 arc45 328.74,57.98 v331.5,60.73
  Bottom 0.61: 36,60.55 arc-45 D35.- v35.92,59.23 | D37.- 74.02,59.26 v74,59.23 | D41.- v150.22,59.23 | D50.- v331.5,60.73 | D83.- 237.96,19.64 arc-45 238.7,21.43 240.51,23.24 arc45 242,26.84 242,52.06 arc45 241.17,54.06 239.75,55.48 arc-16 238.25,57.48 arc-26 v237.75,59.23 | D48.- 311.54,59.23 arc-45 v312.75,58.73 | U$1.P16 295.49,27.36 arc-45 292.98,28.4 287.54,33.83 arc-45 286.5,36.35 286.5,69.43 arc45 285.76,71.23 281.99,74.99 arc45 280.2,75.73 269.05,75.73 arc45 v267.26,74.99 | D39.- v112.12,59.23 | D43.- v188.32,59.23 | D45.- v226.42,59.23
L6  (via drill 0.35)
  Top 0.61: v40.69,43.23 v78.79,43.23 v116.89,43.23 v155,43.23 v193.09,43.23 v231.19,43.23 256.07,43.23 arc-45 257.87,42.49 279.13,21.23 arc45 280.93,20.48 289.7,20.48 arc45 291.49,21.23 294.34,24.07 arc-45 296.14,24.82 U$1.P15 302.53,24.82 arc45 304.33,25.56 308.51,29.74 arc45 309.25,31.53 309.25,64.88 arc45 307.76,68.47 303.24,72.99 arc45 299.65,74.48 275.8,74.48 arc45 274.01,73.74 v269.51,69.38
  Bottom 0.61: D56.- arc45 117,41.97 | D58.- arc45 155,41.72 v155,43.23 | 193,41.9 arc45 D60.- v193.09,43.23 | D88.- 339.45,3.07 arc-45 339.2,2.46 arc-45 338.35,2.11 334.75,2.11 arc-45 332.15,3.18 328.35,6.98 arc-45 327.75,8.43 327.75,14.44 arc90 324.21,17.98 317.75,17.98 arc-90 316.62,19.11 316.62,20.86 arc90 315.75,21.73 303.76,21.73 arc-45 300.76,22.98 299.73,24 arc45 U$1.P15 | D81.- 128.08,3.75 arc-45 124.49,5.24 119.74,9.99 arc-45 118,14.19 118,34.53 arc16 117.5,37.98 arc-14 D56.- | v269.51,69.38 D47.- | D62.- v231.19,43.23 | D56.- v116.89,43.23 | D54.- v78.79,43.23 | D52.- v40.69,43.23
L7  (via drill 0.35)
  Top 0.61: v12,41.73 v50.75,41.73 v57.5,41.73 v95.5,41.73 v133.5,41.73 v171.5,41.73 v210,41.73 v248,41.73 255.57,41.73 arc-45 257.37,40.99 278.13,20.23 arc45 280.53,19.23 290.59,19.23 arc45 292.99,20.23 294.29,21.52 arc-45 296,22.23 297.66,22.23 arc45 U$1.P14 301.99,22.28 arc45 303.79,23.02 309.9,29.13 arc45 310.75,31.18 310.75,50.93 arc-45 311.49,52.73 313.76,54.99 arc-45 315.55,55.73 327.7,55.73 arc45 329.49,56.48 332.47,59.45 arc45 333,60.73 arc45 332.47,62.01 330.99,63.49 arc-45 330.25,65.28 330.25,74.43 arc-45 330.99,76.23 v334.5,79.73
  Bottom 0.61: D51.- arc45 14.4,41.73 v12,41.73 | D53.- arc45 59.64,41.73 v57.5,41.73 | D57.- arc45 135.84,41.73 v133.5,41.73 | D55.- arc45 97.74,41.73 v95.5,41.73 | D59.- arc45 173.94,41.73 v171.5,41.73 | D61.- arc45 212.04,41.73 v210,41.73 | D63.- arc45 250.14,41.73 v248,41.73 | D80.- 56.59,3.75 arc-45 52.99,5.24 48.99,9.24 arc-45 47.5,12.84 47.5,14.23 arc38 45.75,17.98 43.24,20.49 arc-45 42.5,22.28 42.5,26.22 arc45 41.88,27.73 arc-45 41.38,28.94 41.38,31.28 arc-45 42.13,33.12 v50.75,41.73 | v334.5,79.73 arc-45 334.64,79.79 D33.-
L8  (via drill 0.35)
  Top 0.61: v41.12,24.23 v69.26,24.23 v107.36,24.23 v145.46,24.23 v183.56,24.23 v221.66,24.23 256.7,24.23 arc-45 258.49,23.49 263.26,18.73 arc45 265.05,17.98 291.95,17.98 arc45 293.74,18.73 v294.62,19.61
  Bottom 0.61: 69,23.06 arc90 D67.- v69.26,24.23 | 107.5,22.94 arc-90 D69.- v107.36,24.23 | 145.5,22.84 arc-90 D71.- v145.46,24.23 | v41.12,24.23 D65.- 39.65,22.38 arc45 40.39,20.59 44,16.98 arc-45 45.25,13.96 45.25,6.48 arc-90 40.5,1.73 36.3,1.73 arc-45 34.51,2.48 33.76,3.22 arc-45 D79.- | 183.5,22.95 arc45 D73.- v183.56,24.23 | 221.5,23.19 arc45 D75.- v221.66,24.23 | U$1.P29 290.14,25.14 arc45 290.89,23.34 v294.62,19.61 297.88,16.35 arc45 299.68,15.61 309.6,15.61 arc45 311.4,16.35 D77.-
L9  (via drill 0.35)
  Top 0.61: v2.5,20.73 3.76,21.99 arc-45 5.55,22.73 v7.5,22.73 23.95,22.73 arc-45 25.74,21.99 26.76,20.98 arc45 28.55,20.23 36.95,20.23 arc45 38.74,20.98 39.76,21.99 arc-45 41.55,22.73 v48,22.73 v86,22.73 v124.5,22.73 v162.5,22.73 v200.5,22.73 v256.88,22.73
  Bottom 0.61: D64.- arc-45 9.56,22.73 v7.5,22.73 | D66.- arc-45 50.05,22.73 v48,22.73 | D68.- arc-45 88.15,22.73 v86,22.73 | D70.- arc-45 126.25,22.73 v124.5,22.73 | D72.- arc-45 164.35,22.73 v162.5,22.73 | D78.- 7.53,3.75 arc-45 6.16,4.32 1.92,8.56 arc-45 1.25,10.18 1.25,18.53 arc-45 1.92,20.15 v2.5,20.73 | v200.5,22.73 202.45,22.73 arc45 D74.- | v256.88,22.73 266.75,22.73 | 266.75,22.73 266.93,22.73 D76.- | U$1.P13 266.75,22.28 266.75,22.73
N$1
  Bottom 0.61: K_RIGHT.PIN2 330.18,8.85 arc45 330.92,7.06 333.49,4.49 arc45 335.28,3.75 D88.+
N$2
  Bottom 0.635: K_ECH.PIN1 16.26,116.91 arc-45 17,115.11 17,110.27 arc-90 14.46,107.73 D1.+
N$3
  Bottom 0.635: K_F1.PIN1 54.26,117.01 arc-45 55,115.21 55,111.23 55,110.73 55,110.27 arc-90 52.46,107.73 D2.+
N$4
  Bottom 0.635: F_F2.PIN1 73.26,117.06 arc-45 74,115.26 74,110.27 arc-90 71.46,107.73 D3.+
N$5
  Bottom 0.635: K_F3.PIN1 92.26,117.11 arc-45 93,115.31 93,110.27 arc-90 90.46,107.73 D4.+
N$6
  Bottom 0.635: K_F4.PIN1 111.26,117.16 arc-45 112,115.36 112,110.27 arc-90 109.46,107.73 D5.+
N$7
  Bottom 0.635: K_F5.PIN1 140.26,116.73 arc-45 141,114.93 141,110.27 arc-90 138.46,107.73 D6.+
N$8
  Bottom 0.635: K_F6.PIN1 159.26,116.78 arc-45 160,114.98 160,110.27 arc-90 157.46,107.73 D7.+
N$9
  Bottom 0.635: K_F7.PIN1 178.26,116.83 arc-45 179,115.03 179,110.27 arc-90 176.46,107.73 D8.+
N$10
  Bottom 0.635: K_F8.PIN1 197.26,116.88 arc-45 198,115.08 198,110.27 arc-90 195.46,107.73 D9.+
N$11
  Bottom 0.635: K_F9.PIN1 226.26,116.46 arc-45 227,114.66 227,110.27 arc-90 224.46,107.73 D10.+
N$12
  Bottom 0.635: K_F10.PIN1 245.26,116.51 arc-45 246,114.71 246,110.27 arc-90 243.46,107.73 D11.+
N$13
  Bottom 0.635: K_F11.PIN1 264.26,116.56 arc-45 265,114.76 265,110.27 arc-90 262.46,107.73 D12.+
N$14
  Bottom 0.635: K_F12.PIN1 283.26,116.61 arc-45 284,114.81 284,112.81 arc-90 278.92,107.73 D13.+
N$15
  Bottom 0.635: K_PRNT.PIN1 307.26,116.61 arc-45 308,114.81 308,110.27 arc-90 305.46,107.73 D14.+
N$16
  Bottom 0.635: K_SCROL.PIN1 326.26,116.66 arc-45 327,114.86 327,110.27 arc-90 324.46,107.73 D15.+
N$17
  Bottom 0.635: K_PAUSE.PIN1 344.99,116.97 arc-45 345.38,116.04 345.38,109.65 arc-90 343.46,107.73 D16.+
N$18
  Bottom 0.635: K_PUP.PIN1 344.76,89.27 arc-45 345.38,87.77 345.38,82.21 arc-90 342.96,79.79 D33.+
N$19
  Bottom 0.635: K_HOME.PIN1 325.76,89.22 arc-45 326.5,87.42 326.5,82.33 arc-90 323.96,79.79 D32.+
N$20
  Bottom 0.61: K_INSERT.PIN1 arc-90 304.07,77.73 299.75,77.73 arc-45 298.26,78.35 295.77,80.83 arc-45 294.94,82.84 D31.+
N$21
  Bottom 0.61: D30.+ 273.32,89.87 K_BACK.PIN1
N$22
  Bottom 0.635: K_PLUS.PIN1 244.76,89.07 arc-45 245.5,87.27 245.5,82.33 arc-90 242.96,79.79 D29.+
N$23
  Bottom 0.635: K_MINUS.PIN1 225.76,89.02 arc-45 226.5,87.22 226.5,82.33 arc-90 223.96,79.79 D28.+
N$24
  Bottom 0.635: K_0.PIN1 206.76,88.97 arc-45 207.5,87.17 207.5,82.33 arc-90 204.96,79.79 D27.+
N$25
  Bottom 0.635: K_9.PIN1 187.76,88.92 arc-45 188.5,87.12 188.5,82.33 arc-90 185.96,79.79 D26.+
N$26
  Bottom 0.635: K_8.PIN1 168.26,89.37 arc-45 169,87.57 169,82.33 arc-90 166.46,79.79 D25.+
N$27
  Bottom 0.635: K_7.PIN1 149.26,89.32 arc-45 150,87.52 150,83.73 150,83.23 150,82.33 arc-90 147.46,79.79 D24.+
N$28
  Bottom 0.635: K_6.PIN1 130.26,89.27 arc-45 131,87.47 131,82.33 arc-90 128.46,79.79 D23.+
N$29
  Bottom 0.635: K_5.PIN1 111.26,89.22 arc-45 112,87.42 112,82.33 arc-90 109.46,79.79 D22.+
N$30
  Bottom 0.635: K_4.PIN1 92.26,89.17 arc-45 93,87.37 93,82.33 arc-90 90.46,79.79 D21.+
N$31
  Bottom 0.635: K_3.PIN1 73.26,89.12 arc-45 74,87.32 74,85.23 74,84.73 74,82.33 arc-90 71.46,79.79 D20.+
N$32
  Bottom 0.635: K_2.PIN1 54.26,89.07 arc-45 55,87.27 55,82.33 arc-90 52.46,79.79 D19.+
N$33
  Bottom 0.635: K_1.PIN1 35.26,89.02 arc-45 36,87.22 36,82.33 arc-90 33.46,79.79 D18.+
N$34
  Bottom 0.635: Κ_GRV.PIN1 16.26,88.97 arc-45 17,87.17 17,82.33 arc-90 14.46,79.79 D17.+
N$35
  Bottom 0.635: K_TAB.PIN1 arc-90 21.5,69.43 21.5,63.27 arc-90 18.96,60.73 D34.+
N$36
  Bottom 0.635: K_Q.PIN1 arc-90 45.5,69.25 45.5,63.27 arc-90 42.96,60.73 D35.+
N$37
  Bottom 0.635: K_W.PIN1 arc-90 64.5,69.3 64.5,63.27 arc-90 61.96,60.73 D36.+
N$38
  Bottom 0.635: K_E.PIN1 arc-90 83.5,69.35 83.5,63.27 arc-90 80.96,60.73 D37.+
N$39
  Bottom 0.635: K_R.PIN1 arc-90 102.5,69.4 102.5,63.27 arc-90 99.96,60.73 D38.+
N$40
  Bottom 0.635: K_T.PIN1 arc-90 121.5,69.45 121.5,66.23 121.5,65.73 121.5,63.27 arc-90 118.96,60.73 D39.+
N$41
  Bottom 0.635: K_Y.PIN1 arc-90 140.5,69.5 140.5,63.27 arc-90 137.96,60.73 D40.+
N$42
  Bottom 0.635: K_U.PIN1 arc-90 159.5,69.55 159.5,63.27 arc-90 156.96,60.73 D41.+
N$43
  Bottom 0.635: K_I.PIN1 arc-90 179,69.1 179,65.73 179,65.23 179,63.27 arc-90 176.46,60.73 D42.+
N$44
  Bottom 0.635: K_O.PIN1 arc-90 198,69.15 198,63.27 arc-90 195.46,60.73 D43.+
N$45
  Bottom 0.635: K_P.PIN1 arc-90 217,69.2 217,63.27 arc-90 214.46,60.73 D44.+
N$46
  Bottom 0.635: K_LBRA.PIN1 arc-90 235.5,69.75 235.5,62.77 arc-90 233.46,60.73 D45.+
N$47
  Bottom 0.635: K_RBRA.PIN1 arc-90 255,69.3 255,63.27 arc-90 252.46,60.73 D46.+
N$48
  Bottom 0.61: D47.+ K_ENTER.PIN1 arc-90 K_ENTER.PIN1
N$49
  Bottom 0.61: D48.+ 304.94,59.23 arc-90 K_DELETE.PIN1
N$50
  Bottom 0.635: K_END.PIN1 arc-90 326,69.92 326,62.77 arc-90 323.96,60.73 D49.+
N$51
  Bottom 0.635: K_PDW.PIN1 arc-90 345.38,69.6 345.38,63.15 arc-90 342.96,60.73 D50.+
N$52
  Bottom 0.635: K_CAPSLOCK.PIN1 arc-90 24,50.27 24,44.23 arc-90 21.46,41.69 D51.+
N$53
  Bottom 0.635: K_A.PIN1 arc-90 50,50.46 50,44.23 arc-90 47.46,41.69 D52.+
N$54
  Bottom 0.635: K_S.PIN1 arc-90 69,50.51 69,44.23 arc-90 66.46,41.69 D53.+
N$55
  Bottom 0.635: K_D.PIN1 arc-90 88,50.56 88,44.23 arc-90 85.46,41.69 D54.+
N$56
  Bottom 0.635: K_F.PIN1 arc-90 107,50.61 107,44.23 arc-90 104.46,41.69 D55.+
N$57
  Bottom 0.635: K_G.PIN1 arc-90 126,50.66 126,44.23 arc-90 123.46,41.69 D56.+
N$58
  Bottom 0.635: K_H.PIN1 144.76,50.95 arc-45 145.5,49.16 145.5,44.23 arc-90 142.96,41.69 D57.+
N$59
  Bottom 0.635: K_J.PIN1 arc-90 164.5,50.26 164.5,44.23 arc-90 161.96,41.69 D58.+
N$60
  Bottom 0.635: K_K.PIN1 arc-90 183.5,50.31 183.5,44.23 arc-90 180.96,41.69 D59.+
N$61
  Bottom 0.635: K_L.PIN1 arc-90 202.5,50.36 202.5,44.23 arc-90 199.96,41.69 D60.+
N$62
  Bottom 0.635: K_SEMIC.PIN1 arc-90 221.5,50.41 221.5,44.23 arc-90 218.96,41.69 D61.+
N$63
  Bottom 0.635: K_QUOTE.PIN1 arc-90 240.5,50.46 240.5,44.23 arc-90 237.96,41.69 D62.+
N$64
  Bottom 0.635: K_WAVE.PIN1 arc-90 259.12,50.88 259.12,43.86 arc-90 256.96,41.69 D63.+
N$65
  Bottom 0.635: K_LSHFT.PIN1 18.26,32.36 arc-45 19,30.56 19,25.34 arc-90 16.46,22.8 D64.+
N$66
  Bottom 0.61: K_PIPE.PIN2 33.81,20.18 arc90 36.35,22.72 D65.+
N$67
  Bottom 0.635: D66.+ 56.96,22.8 arc90 59.5,25.34 59.5,30.54 arc45 58.76,32.34 K_Z.PIN1
N$68
  Bottom 0.635: K_X.PIN1 arc-90 78.5,31.64 78.5,25.34 arc-90 75.96,22.8 D67.+
N$69
  Bottom 0.635: K_C.PIN1 97.26,31.94 arc-45 98,30.14 98,25.34 arc-90 95.46,22.8 D68.+
N$70
  Bottom 0.635: K_V.PIN1 116.26,31.99 arc-45 116.5,31.4 116.5,24.84 arc-90 114.46,22.8 D69.+
N$71
  Bottom 0.635: K_B.PIN1 135.26,32.04 arc-45 136,30.24 136,25.34 arc-90 133.46,22.8 D70.+
N$72
  Bottom 0.635: K_N.PIN1 154.26,32.09 arc-45 155,30.29 155,25.34 arc-90 152.46,22.8 D71.+
N$73
  Bottom 0.635: K_M.PIN1 173.26,32.14 arc-45 174,30.34 174,25.34 arc-90 171.46,22.8 D72.+
N$74
  Bottom 0.61: K_COMA.PIN1 192.25,32.19 arc-45 192.62,31.29 192.62,25.47 arc-90 189.96,22.8 D73.+
N$75
  Bottom 0.61: D74.+ 209.46,22.8 arc90 212,25.34 212,30.44 arc45 211.26,32.24
  Bottom 0.635: K_DOT.PIN1 211.26,32.24
N$76
  Bottom 0.61: D75.+ 228.46,22.8 arc90 231,25.34 231,30.73 arc45 230.43,32.12 K_SLASH.PIN1
N$77
  Bottom 0.61: D76.+ 266.93,30.28 arc45 266.19,32.07 K_RSHFT.PIN1
N$78
  Bottom 0.61: K_UP.PIN1 323.11,20.73 arc-45 321.31,19.98 D77.+
N$79
  Bottom 0.635: K_LCTRL.PIN1 18.26,13.31 arc-45 19,11.51 19,6.29 arc-90 16.46,3.75 D78.+
N$80
  Bottom 0.635: K_LWIN.PIN1 42.26,13.12 arc-45 43,11.32 43,6.29 arc-90 40.46,3.75 D79.+
N$81
  Bottom 0.61: K_RALT.PIN1 209.26,12.81 arc-45 210,11.01 210,6.29 arc-90 207.46,3.75 D82.+
N$82
  Bottom 0.635: K_SPACE.PIN1 137.76,12.87 arc-45 138.5,11.07 138.5,6.29 arc-90 135.96,3.75 D81.+
N$83
  Bottom 0.61: D83.+ 232.33,13.71 arc-45 K_RWIN.PIN1
N$84
  Bottom 0.61: D84.+ 254.46,3.75 arc90 257,6.29 257,12.48 arc45 256.86,12.83 K_RCTRL.PIN1
N$85
  Bottom 0.61: D85.+ 265.93,4.1 arc-45 K_FN.PIN1
N$86
  Bottom 0.61: K_LEFT.PIN1 K_LEFT.PIN1 arc-45 291.33,2.83 D86.+
N$87
  Bottom 0.635: K_DOWN.PIN1 325.76,13.17 arc-45 326.38,11.68 326.38,6.17 arc-90 323.96,3.75 D87.+
N$88  (via drill 0.35)
  Top 0.61: v302.62,98.73 297.55,98.73 arc45 295.76,97.99 280.74,82.98 arc-45 279.55,82.48 269.73,82.48 arc-45 v269.12,82.73
  Bottom 0.61: R_CAPS.2 arc-45 303.91,98.73 v302.62,98.73 | U$1.P3 281.61,47.68 arc-45 279.81,48.42 278.71,49.52 arc-45 278,51.23 278,65.68 arc45 277.26,67.48 273.5,71.23 arc45 272.29,71.73 268.05,71.73 arc-45 266.26,72.48 262.62,76.11 arc-45 261.68,78.37 arc-45 262.55,80.47 arc-45 264.38,81.23 266.32,81.23 arc38 268.12,81.86 arc6 v269.12,82.73
N$89  (via drill 0.35)
  Top 0.61: v269.38,81.11 280,81.11 arc45 281.49,81.73 295.76,95.99 arc-45 297.55,96.73 318.45,96.73 arc45 320.5,97.58 v321.75,98.83
  Bottom 0.61: R_SCROLL.2 arc-45 323.16,98.83 v321.75,98.83 | v269.38,81.11 268.74,80.48 arc-45 266.95,79.73 264.5,79.73 arc90 263.25,78.48 263.25,78.23 arc45 263.96,76.52 266.51,73.98 arc45 268.3,73.23 272.45,73.23 arc-45 274.24,72.49 278.76,67.98 arc-45 279.5,66.18 279.5,51.94 arc45 280,50.73 arc45 281.24,50.22 U$1.P2
N$90
  Bottom 0.61: R_CAPS.1 D_CAPS.A
N$91
  Bottom 0.61: R_SCROLL.1 D_SCROLL.A
N$92
  Top 0.61: SW1.1 SW1.2 300.75,45.03 arc-45 300.5,45.14 | R_RESETPU.2 297.9,45.08 arc-45 U$1.P23
  Top 0.813: 300.5,45.14 R_RESETPU.2
N$93
  Top 0.61: U$1.P22 298.66,42.6 arc45 300.46,43.34
  Top 0.813: 300.46,43.34 R_RESETPU.1
N$95
  Top 0.813: TP1.P$1 297.76,52.73 U$1.P26
  Bottom 0.813: U$1.P26 297.76,52.73 TP1.P$1
N$96
  Top 0.813: TP3.P$1 297.76,50.23 U$1.P25
  Bottom 0.813: U$1.P25 301,50.22 TP3.P$1
N$102
  Bottom 0.635: K_LALT.PIN1 66.26,12.93 arc-45 67,11.13 67,6.29 arc-90 64.46,3.75 D80.+

## Text on the board
122bmp: C:/Users/Synless/Desktop/S.bmp
200bmp: C:/Users/Synless/Desktop/S.bmp
201bmp: C:/Users/Synless/Desktop/Y.bmp